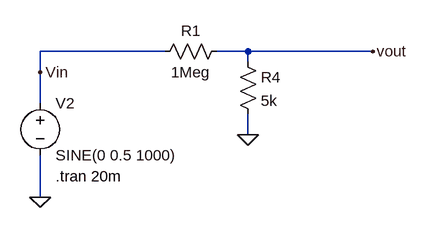
[diagram p0: schematic Equivalent_Circuit_No_Bypass.asc]
Equivalent_Circuit_No_Bypass.asc, the LTspice schematic file:
Version 4
SHEET 1 3112 2308
WIRE 400 48 208 48
WIRE 528 48 480 48
WIRE 720 48 528 48
WIRE 528 64 528 48
WIRE 208 80 208 48
WIRE 208 128 208 80
WIRE 528 176 528 144
WIRE 208 272 208 208
FLAG 208 272 0
FLAG 720 48 vout
FLAG 208 80 Vin
FLAG 528 176 0
SYMBOL voltage 208 112 R0
WINDOW 123 24 124 Left 2
WINDOW 39 0 0 Left 2
SYMATTR InstName V2
SYMATTR Value SINE(0 0.5 1000)
SYMBOL res 496 32 R90
WINDOW 0 0 56 VBottom 2
WINDOW 3 32 56 VTop 2
SYMATTR InstName R1
SYMATTR Value 1Meg
SYMBOL res 512 48 R0
WINDOW 0 36 40 Left 2
WINDOW 3 36 76 Left 2
SYMATTR InstName R4
SYMATTR Value 5k
TEXT 232 240 Left 2 !.tran 20m

The netlist it stands for:
* Equivalent_Circuit_No_Bypass.asc
V2 Vin 0 SINE(0 0.5 1000)
R1 vout Vin 1Meg
R4 vout 0 5k
.tran 20m
.backanno
.end